# EAGLE design 2x6x1.27mm-pogo-adapter-mk-2.0.0 (EAGLE 9.3.1)
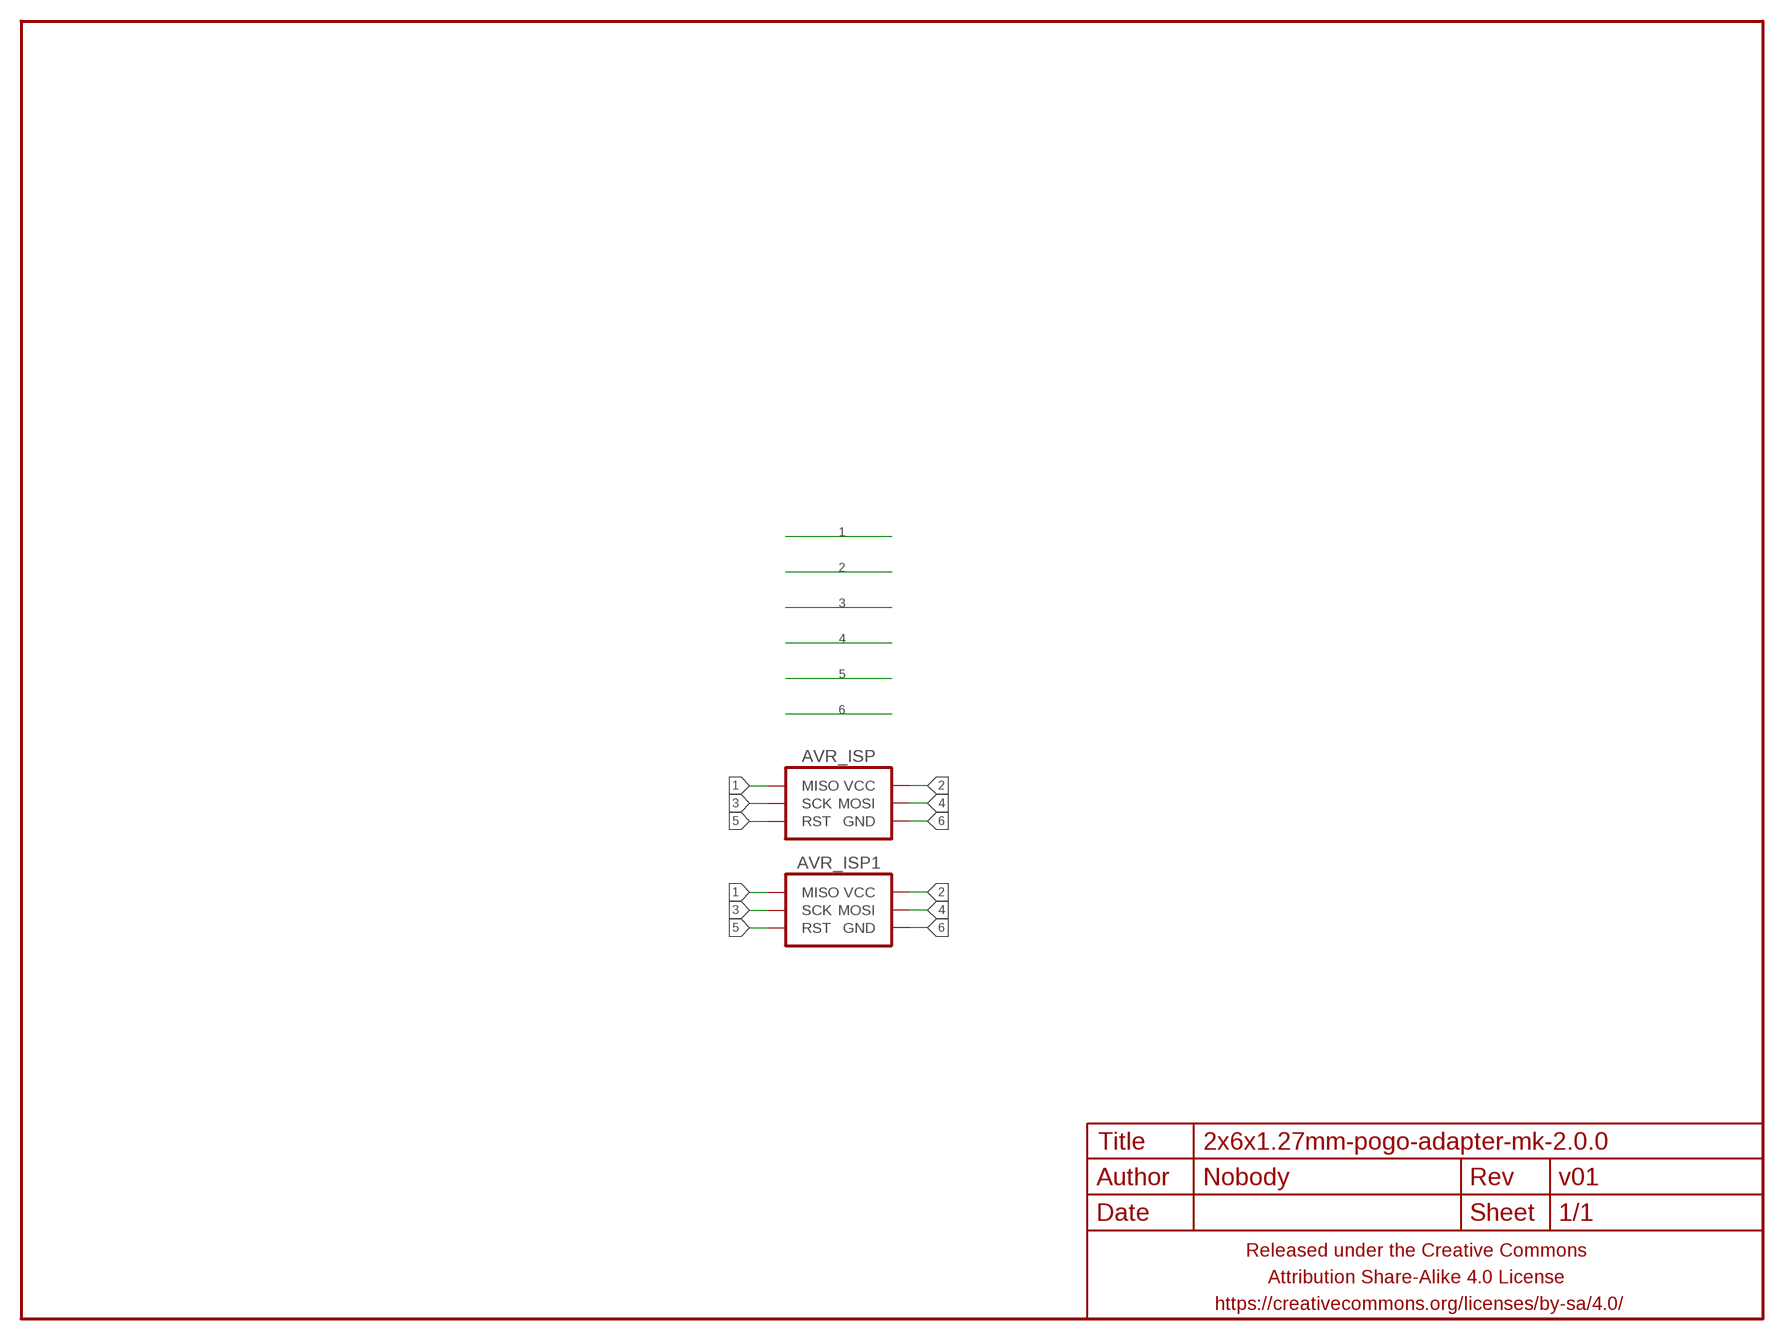
[diagram p0: schematic, sheet 1]

## Parts
AVR_ISP  AVR_SPI_PRG_6SMD_POGO_POGO_POGO_BOUNCE_AVRISP  [2X3_SMD_POGO_RA_NARROW_AVRISP]
AVR_ISP1  AVR_SPI_PRG_6PTH  [2X3]
FRAME1  FRAME-LETTERNO_PACKAGE  [DUMMY]

## Nets
1: AVR_ISP1.1(MISO) AVR_ISP.1@1(MISO) AVR_ISP.1@2(MISO)
2: AVR_ISP1.2(VCC) AVR_ISP.2@1(VCC) AVR_ISP.2@2(VCC)
3: AVR_ISP1.3(SCK) AVR_ISP.3@1(SCK) AVR_ISP.3@2(SCK)
4: AVR_ISP1.4(MOSI) AVR_ISP.4@1(MOSI) AVR_ISP.4@2(MOSI)
5: AVR_ISP1.5(RST) AVR_ISP.5@1(RST) AVR_ISP.5@2(RST)
6: AVR_ISP1.6(GND) AVR_ISP.6@1(GND) AVR_ISP.6@2(GND)

## Library data of the parts
AVR_ISP AVR_ISP1 = a_parts:AVR_SPI_PRG_6: AVR ISP 6 Pin This is the reduced ISP connector for AVR programming. Common on Arduino. This footprint will take up less PCB space and can be used with a 10-pin to 6-pin adapter such as SKU: BOB-08508 **Special note about "TEST_POINT" package. The stop mask is on the top side, so if you want your programming test points to be on the bottom of your board, make sure to place this package on the bottom side of the board. This also ensure that the orientation to program from the bottom side will be correct.
FRAME1 = a_parts:FRAME-LETTER: Schematic Frame Standard 8.5x11 US Letter frame; DESIGNER: Nobody; VERSION: v01

## Board
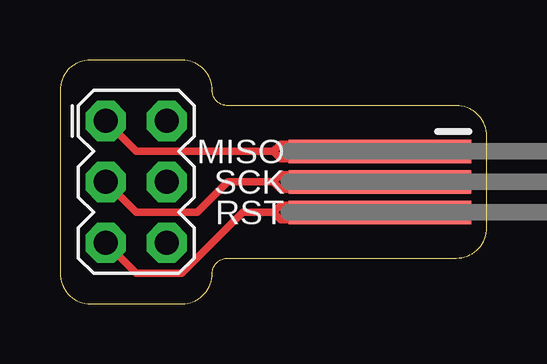
[diagram p1: board, top side]
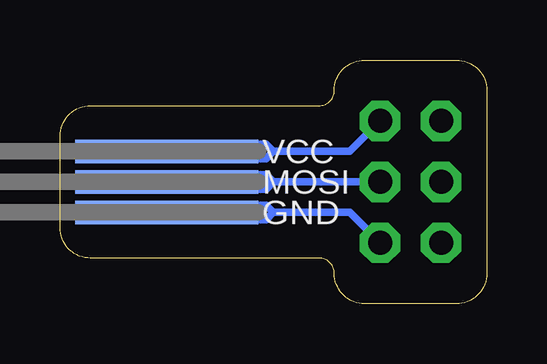
[diagram p2: board, bottom side, seen from below]

Size 17.78 x 10.16 mm. Coordinates in mm from the lower left corner, seen from the top.
Outline: 6.99,1.91 16.51,1.91 arc90 17.78,3.17 17.78,6.99 arc90 16.51,8.26 6.99,8.26 arc-90 6.35,8.89 arc90 5.08,10.16 1.27,10.16 arc90 0,8.89 0,1.27 arc90 1.27,0 5.08,0 arc90 6.35,1.27 arc-90 6.99,1.91
Copper layers (1*16): Top 0.035559375mm / dielectric 1.6mm / Bottom 0.035559375mm
Design rules "oshpark-2layer": minimum track width 6mil, minimum drill 10mil, track to track 6mil, track to pad 6mil, pad to pad 6mil, via to via 6mil, smd to smd 0mil, copper to edge 15mil, drill to drill 6mil, minimum pad ring 5mil, minimum via ring 5mil, stop-mask expansion 2.5mil, vias tented up to drill 20mil, thermal gap 10mil

### Footprints (pad centres in the part's own frame; a part is rotated, then mirrored left to right if it is on the bottom)
2X3_SMD_POGO_RA_NARROW_AVRISP = smd 0.381 x 7.62: 1@1 -1.575,0; 1@2 -0.965,0; 3@1 -0.305,0; 3@2 0.305,0; 5@1 0.965,0; 5@2 1.575,0 | smd 0.381 x 7.62 bottom: 2@1 -1.575,0; 2@2 -0.965,0; 4@1 -0.305,0; 4@2 0.305,0; 6@1 0.965,0; 6@2 1.575,0
2X3 = drill 1 pad 1.676 octagon: 1 -2.54,-1.27; 2 -2.54,1.27; 3 0,-1.27; 4 0,1.27; 5 2.54,-1.27; 6 2.54,1.27

### Placement (x,y rotation side)
AVR_ISP  13.34,5.08 270 top
AVR_ISP1  3.17,5.08 270 top
FRAME1  0,0 0 top

### Tracks (layer width: path | path; a pad name or v marks a point on that pad's centre or on a via)
1
  Top 0.305: AVR_ISP1.1 3.17,6.35 8.89,6.35 | 8.89,6.35 9.2,6.66 AVR_ISP.1@1 | 8.89,6.35 9.2,6.04 AVR_ISP.1@2
2
  Bottom 0.305: AVR_ISP1.2 5.71,6.35 8.89,6.35 | 8.89,6.35 9.2,6.66 AVR_ISP.2@1 | 8.89,6.35 9.2,6.04 AVR_ISP.2@2
3
  Top 0.305: AVR_ISP1.3 3.17,3.81 5.71,3.81 6.99,5.08 8.89,5.08 | 8.89,5.08 9.2,5.38 AVR_ISP.3@1 | 8.89,5.08 9.2,4.78 AVR_ISP.3@2
4
  Bottom 0.305: AVR_ISP1.4 8.89,5.08 | 8.89,5.08 9.2,5.38 AVR_ISP.4@1 | 8.89,5.08 9.2,4.78 AVR_ISP.4@2
5
  Top 0.305: AVR_ISP1.5 3.17,1.27 5.08,1.27 7.62,3.81 8.89,3.81 | 8.89,3.81 9.2,4.12 AVR_ISP.5@1 | 8.89,3.81 9.2,3.5 AVR_ISP.5@2
6
  Bottom 0.305: AVR_ISP1.6 5.71,3.81 8.89,3.81 | 8.89,3.81 9.2,4.12 AVR_ISP.6@1 | 8.89,3.81 9.2,3.5 AVR_ISP.6@2